# Altium project BQ_79600-Q1_BMS_Master.PrjPcb
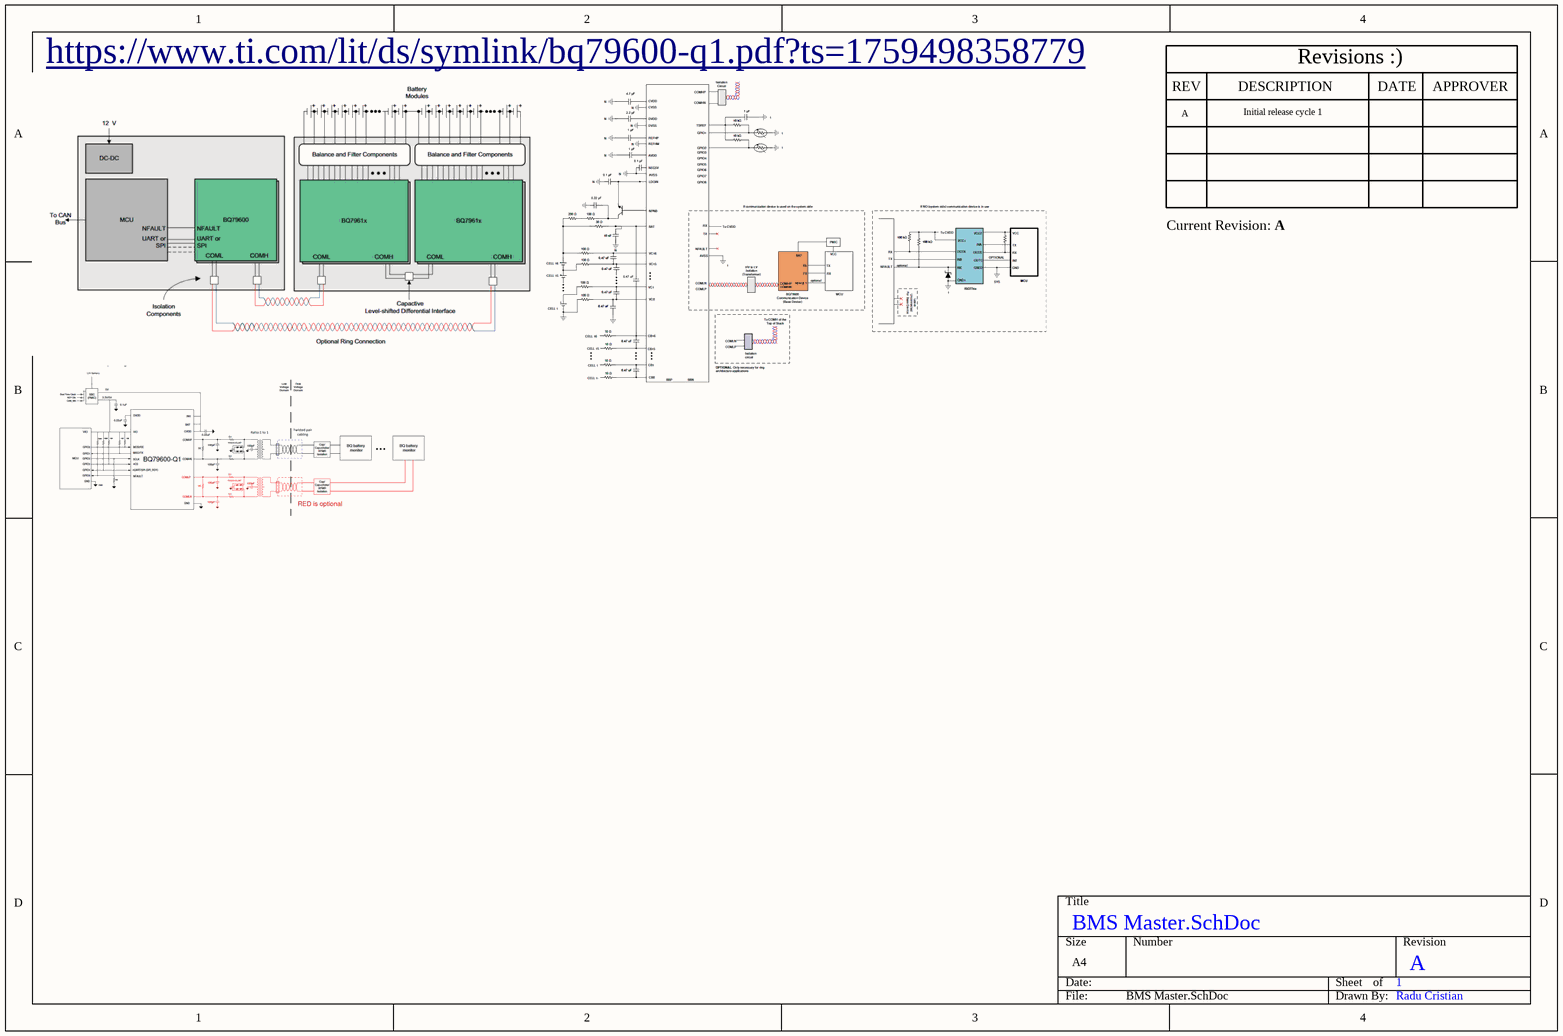
[diagram p0: BMS Master.SchDoc]
Revision: A
6 sheets, 76 parts. Net scope: flat (ports and power ports of the same name join across sheets).
Board file: Bms_Master_RevA.PcbDoc
Sheets:
  BMS Master.SchDoc
  BQ Chip.SchDoc
  MCU.SchDoc
  Communication.SchDoc
  Connectors.SchDoc
  Power.SchDoc

## Sheet BMS Master.SchDoc
size A4; SheetNumber: 1; SheetTotal: 6

### Notes on the sheet
- https://www.ti.com/lit/ds/symlink/bq79600-q1.pdf?ts=1759498358779
- REV
- A
- DESCRIPTION
- Initial release cycle 1
- Revisions :)
- DATE
- APPROVER
- Current Revision:
- Radu Cristian

## Sheet BQ Chip.SchDoc
size A4; SheetNumber: 2; SheetTotal: 6
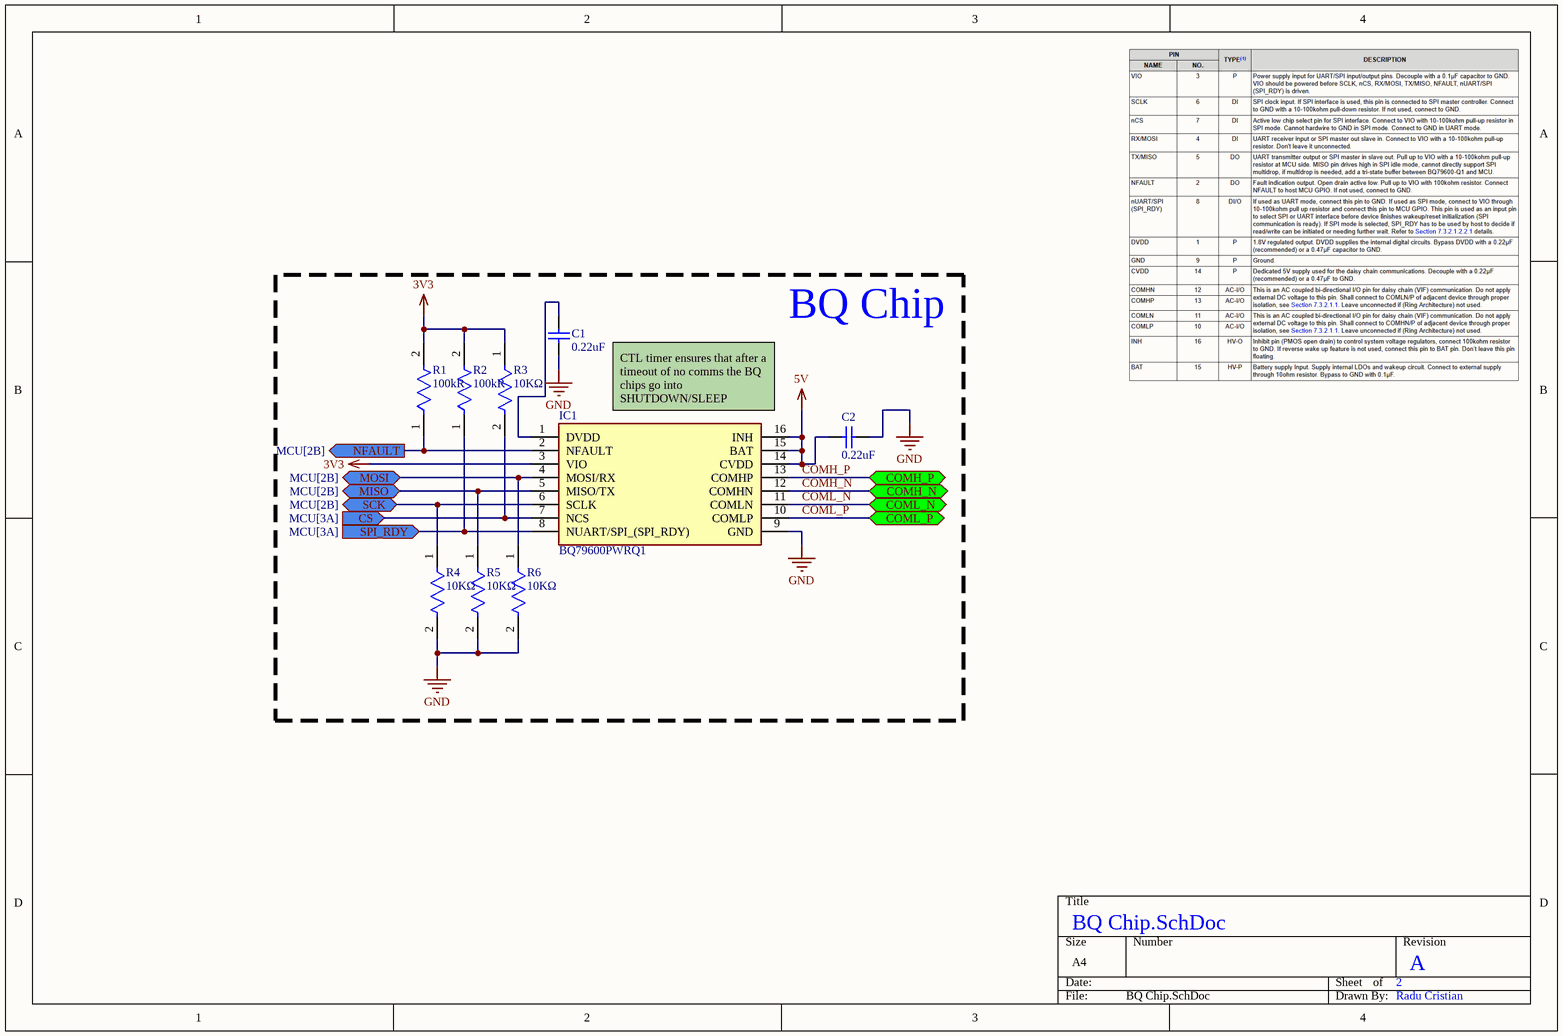
[diagram p1: BQ Chip.SchDoc]

### Parts
C1  Parameter 1: 0.22uF  [CAPC1608X95X40ML15T15]  (hidden comment: VJ0603Y224KXXCW1BC)
C2  Parameter 1: 0.22uF  [CAPC1608X95X40ML15T15]  (hidden comment: VJ0603Y224KXXCW1BC)
IC1  BQ79600PWRQ1  [SOP65P640X120-16N]
R1  Resistance: 100kR  [FP-MCT0603-IPC_C]  (hidden comment: MCT0603MC1003FP500)
R2  Resistance: 100kR  [FP-MCT0603-IPC_C]  (hidden comment: MCT0603MC1003FP500)
R3  Resistance: 10KΩ  [FP-CRGP0603-IPC_C]  (hidden comment: CRGP0603F10K)
R4  Resistance: 10KΩ  [FP-CRGP0603-IPC_C]  (hidden comment: CRGP0603F10K)
R5  Resistance: 10KΩ  [FP-CRGP0603-IPC_C]  (hidden comment: CRGP0603F10K)
R6  Resistance: 10KΩ  [FP-CRGP0603-IPC_C]  (hidden comment: CRGP0603F10K)

### Blocks framed on the sheet
BQ Chip: C1 C2 IC1 R1-R6

### Ports
COMH_N (bidir, see Communication[1B]), COMH_P (bidir, see Communication[1A]), COML_N (bidir, see Communication[1C]), COML_P (bidir, see Communication[1B]), CS (in, see MCU[3A]), MISO (bidir, see MCU[2B]), MOSI (bidir, see MCU[2B]), NFAULT (out, see MCU[2B]), SCK (bidir, see MCU[2B]), SPI_RDY (in, see MCU[3A])

### Nets
3V3: IC1.3(VIO) R1.2 R2.2 R3.1
5V: C2.2 IC1.14(CVDD) IC1.15(BAT) IC1.16(INH)
GND: C1.2 C2.1 IC1.9(GND) R4.2 R5.2 R6.2
COMH_N: IC1.12(COMHN) ; port COMH_N
COMH_P: IC1.13(COMHP) ; port COMH_P
COML_N: IC1.11(COMLN) ; port COML_N
COML_P: IC1.10(COMLP) ; port COML_P
CS: IC1.7(NCS) R3.2 ; port CS
MISO: IC1.5(MISO/TX) R5.1 ; port MISO
MOSI: IC1.4(MOSI/RX) R6.1 ; port MOSI
NFAULT: IC1.2(NFAULT) R1.1 ; port NFAULT
SCK: IC1.6(SCLK) R4.1 ; port SCK
SPI_RDY: IC1.8(NUART/SPI_(SPI_RDY)) R2.1 ; port SPI_RDY
NetC1_1: C1.1 IC1.1(DVDD)

### Notes on the sheet
- (near IC1) CTL timer ensures that after a  timeout of no comms the BQ chips go into SHUTDOWN/SLEEP
- Radu Cristian

### Library data of the parts
C1 C2 = CMP-2006-00068-1: Manufacturer: Vitramon; Part Number: VJ0603Y224KXXCW1BC
IC1 = BQ79600PWRQ1: Integrated Circuit; Manufacturer_Name: Texas Instruments; Datasheet Link: https://www.arrow.com/en/products/bq79600pwrq1/texas-instruments; Height: 1.2mm; Manufacturer_Part_Number: BQ79600PWRQ1; Mouser Part Number: 595-BQ79600PWRQ1; Mouser Price/Stock: https://www.mouser.co.uk/ProductDetail/Texas-Instruments/BQ79600PWRQ1?qs=bAKSY%2FctAC74v4PXQeVHrA%3D%3D; Arrow Part Number: BQ79600PWRQ1; Arrow Price/Stock: https://www.arrow.com/en/products/bq79600pwrq1/texas-instruments?region=nac
R1 R2 = CMP-02407-008119-1: RES SMD 100 OHM 1% 1/8W 0603; Voltage Rating: 75V; Power Rating: 125mW; Length: 1.55mm; Packaging: Tape and Reel; Width: 0.85mm; Case Code (Metric): 1608; Weight: 6.7E-05oz; Tolerance: 1%; Height: 0.45mm; Case Code (Imperial): 0603; Max Operating Temperature: 175°C; Case/Package: 0603; Min Operating Temperature: -55°C; Composition: Thin Film
R3-R6 = CMP-03211-004414-1: CRGP 0603 10K 1%; Manufacturer: TE; Voltage Rating: 50V; Power Rating: 0.25W; Value: 10KΩ; Tolerance: 0.01; Temperature Coefficient: ±100ppm/°C; Octopart: https://octopart.com/crgp0603f10k-te+connectivity-91018721; Temperature Range Low: -55°C; Temperature Range High: +155°C; Device Class L3: Chip SMD Resistors; Package: CRGP0603; Height: 0.55mm; Series: CRGP; RoHS: TRUE; Composition: Thick Film; Digikey Description: CRGP 0603 10K 1%; Ipc Land Pattern Name: RESC16080X45; Mouser Description: Res, 10K, 1%, 0.25W, 0603, Thick Film; ComponentLink2Description: Datasheet; ComponentLink2URL: https://www.te.com/commerce/DocumentDelivery/DDEController?Action=srchrtrv&DocNm=9-1773463-9&DocType=DS&DocLang=English; Manufacturer Part Number: CRGP0603F10K; Temperature: -55°C to +155°C; Device Class L1: Passive Components; Lead Free: Yes; Ambient Temperature Range High: +70°C; Device Class L2: Resistors; Automotive: No; Category: Res

## Sheet MCU.SchDoc
size A4; SheetNumber: 3; SheetTotal: 6
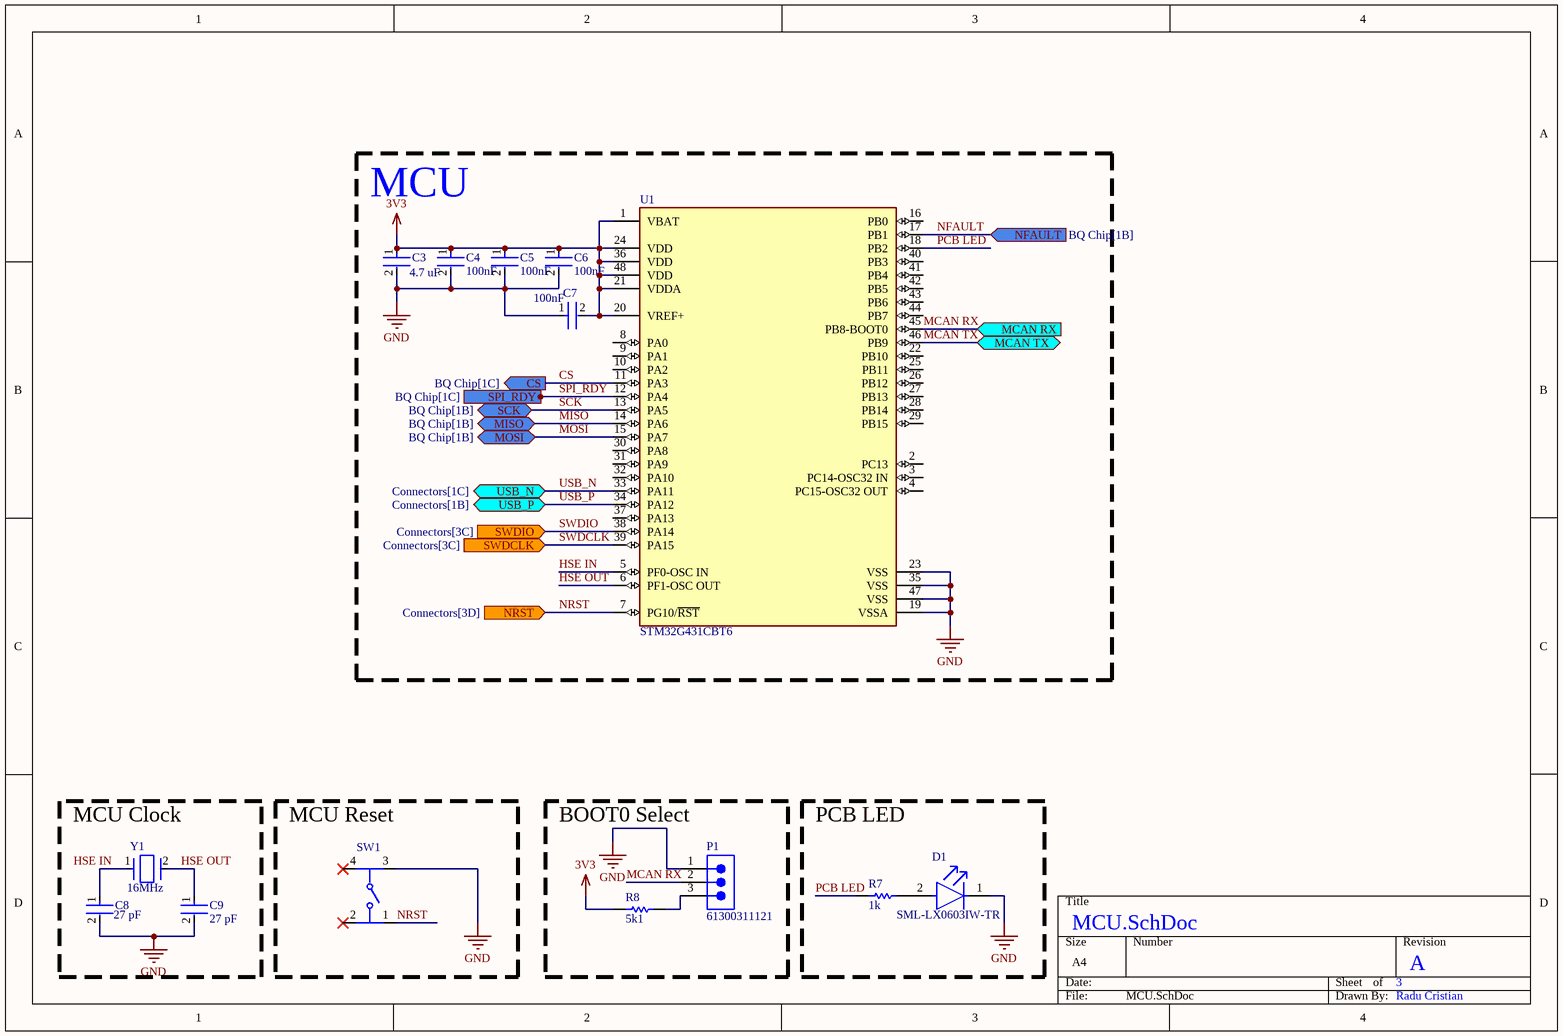
[diagram p2: MCU.SchDoc]

### Parts
C3  Capacitance: 4.7 uF  [FP-CC0603-DA-MFG]  (hidden comment: CC0603KRX5R5BB475)
C4  Capacitance: 100nF  [FP-CC0603-DA-IPC_A]  (hidden comment: CC0603JRX7R9BB104)
C5  Capacitance: 100nF  [FP-CC0603-DA-IPC_A]  (hidden comment: CC0603JRX7R9BB104)
C6  Capacitance: 100nF  [FP-CC0603-DA-IPC_A]  (hidden comment: CC0603JRX7R9BB104)
C7  Capacitance: 100nF  [FP-CC0603-DA-IPC_A]  (hidden comment: CC0603JRX7R9BB104)
C8  value 27 pF  [FP-C0603C-CF-MFG]  (hidden comment: C0603C270J5GACTU)
C9  value 27 pF  [FP-C0603C-CF-MFG]  (hidden comment: C0603C270J5GACTU)
D1  SML-LX0603IW-TR  [FP-SML-LX0603IW-TR-MFG]
P1  61300311121  [61300311121]
R7  Parameter 1: 1k  [RESC2013X70X40ML20T20]  (hidden comment: ERJ-6ENF1001V)
R8  Parameter 1: 5k1  [RESC2013X60X30NL20T20]  (hidden comment: RK73H2ATTD5101F)
SW1  PTS810SJM250SMTRLFS  [FP-PTS810SJM250SMTRLFS-MFG]  (value not drawn)
U1  STM32G431CBT6  [FP-LQFP48-5B-MFG]
Y1  Frequency: 16MHz  [FP-ABM3-MFG]  (hidden comment: ABM3-16.000MHZ-D2Y-T)

### Blocks framed on the sheet
MCU: C3-C7 U1
MCU Clock: C8 C9 Y1
MCU Reset: SW1
BOOT0 Select: P1 R8
PCB LED: D1 R7

### Ports
CS (out, see BQ Chip[1C]), MCAN RX (in, see Communication[1D]), MCAN TX (bidir, see Communication[1D]), MISO (bidir, see BQ Chip[1B]), MOSI (bidir, see BQ Chip[1B]), NFAULT (in, see BQ Chip[1B]), NRST (in, see Connectors[3D]), SCK (bidir, see BQ Chip[1B]), SPI_RDY (out, see BQ Chip[1C]), SWDCLK (in, see Connectors[3C]), SWDIO (in, see Connectors[3C]), USB_N (bidir, see Connectors[1C]), USB_P (bidir, see Connectors[1B])

### Nets
3V3: C3.1 C4.1 C5.1 C6.1 C7.2 R8.2 U1.1(VBAT) U1.20(VREF+) U1.21(VDDA) U1.24(VDD) U1.36(VDD) U1.48(VDD)
GND: C3.2 C4.2 C5.2 C6.2 C7.1 C8.2 C9.2 D1.1(C) P1.1 SW1.3 U1.19(VSSA) U1.23(VSS) U1.35(VSS) U1.47(VSS)
CS: U1.11(PA3) ; port CS
HSE IN: C8.1 U1.5(PF0-OSC_IN) Y1.1
HSE OUT: C9.1 U1.6(PF1-OSC_OUT) Y1.2
MCAN RX: P1.2 U1.45(PB8-BOOT0) ; port MCAN RX
MCAN TX: U1.46(PB9) ; port MCAN TX
MISO: U1.14(PA6) ; port MISO
MOSI: U1.15(PA7) ; port MOSI
NFAULT: U1.17(PB1) ; port NFAULT
NRST: SW1.1 U1.7(PG10/~{RST}) ; port NRST
PCB LED: R7.1 U1.18(PB2)
SCK: U1.13(PA5) ; port SCK
SPI_RDY: U1.12(PA4) ; port SPI_RDY
SWDCLK: U1.39(PA15) ; port SWDCLK
SWDIO: U1.38(PA14) ; port SWDIO
USB_N: U1.33(PA11) ; port USB_N
USB_P: U1.34(PA12) ; port USB_P
NetD1_2: D1.2(A) R7.2
NetP1_3: P1.3 R8.1

Not connected (* = marked no-connect by the designer): SW1 2* 4*; U1 2(PC13) 3(PC14-OSC32_IN) 4(PC15-OSC32_OUT) 8(PA0) 9(PA1) 10(PA2) 16(PB0) 22(PB10) 25(PB11) 26(PB12) 27(PB13) 28(PB14) 29(PB15) 30(PA8) 31(PA9) 32(PA10) 37(PA13) 40(PB3) 41(PB4) 42(PB5) 43(PB6) 44(PB7)

### Notes on the sheet
- Radu Cristian

### Library data of the parts
C3 = CMP-03422-000495-1: CAP CER 4.7UF 6.3V X5R 0603; Manufacturer: YAGEO; Tolerance: 0.1; Temperature Coefficient: 15%; Material: Ceramic; Voltage Rating: 6.3 V; Height: 0.9mm; Temperature Characteristic: X5R; Value: 4.7 uF; ComponentLink2Description: Datasheet; Mouser Description: Multilayer Ceramic Capacitor, CC Series, 4.7 - F, - 10%, X5R, 6.3 V, 0603 [1608 Metric]; Manufacturer Part Number: CC0603KRX5R5BB475; Voltage: 6.3 V; Device Class L3: Ceramic Capacitors; Temperature: -55°C to +125°C; Octopart: https://octopart.com/cc0603krx5r5bb475-yageo-42244632; Digikey Description: CAP CER 4.7UF 6.3V X5R 0603; Package: CC0603-DA; Device Class L2: Capacitors; Category: Cap; Footprint Url: http://www.yageo.com/exep/pages/download/literatures/UPY-C_GEN_24.pdf; ComponentLink2URL: http://www.yageo.com/documents/recent/UPY-GPHC_X7R_6.3V-to-50V_18.pdf; Temperature Range High: +125°C; Automotive: No; Temperature Range Low: -55°C; Lead Free: Yes; Device Class L1: Passive Components; RoHS: TRUE
C4-C7 = CMP-03422-001490-1: CAP CER 0.1UF 50V X7R 0603; Tolerance: 5%; Number of Pins: 2; Depth: 0.8mm; Weight: 7.1E-05oz; Radiation Hardening: No; Case Code (Metric): 1608; Dielectric: X7R; Max Operating Temperature: 125°C; Voltage Rating (DC): 50V; Case/Package: 0603; Halogen Free: Halogen Free; Mount: Surface Mount; Lead Free: Lead Free; Termination: SMD/SMT; RoHS Compliant: Yes; Length: 1.6mm; Series: CC; Resistor Type: Ceramic; Case Code (Imperial): 0603; Construction: Flat; Width: 0.031inch; Height: 0.8mm; Voltage Rating: 50V; Min Operating Temperature: -55°C; Thickness: 0.035inch; Packaging: Tape and Reel
C8 C9 = CMP-2006-03314-2: CAP CER 27PF 50V C0G/NP0 0603; Manufacturer: KEMET; Tolerance: 0.05; Material: Ceramic; Automotive Grade: Grade 1; Temperature Characteristic: C0G; Temperature Coefficient: 30ppm/°C; RoHS: TRUE; Lead Free: Yes; Automotive: Yes; Category: Cap; Digikey Description: CAP CER 27PF 50V C0G/NP0 0603; Device Class L3: Ceramic Capacitors; Capacitance: 27 pF; Temperature Range High: +125°C; Octopart: https://octopart.com/c0603c270j5gactu-kemet-136059; Temperature Range Low: -55°C; ComponentLink2URL: https://api.kemet.com/component-edge/download/datasheet/C0603C100J5GACAUTO.pdf; Device Class L2: Capacitors; Mouser Description: Multilayer Ceramic Capacitors MLCC - SMD/SMT 50volts 27pF C0G 5%; Device Class L1: Passive Components; ComponentLink2Description: Datasheet; Voltage Rating: 50 V; Package: C0603C-CF; Height: 0.87mm; Temperature: -55°C to +125°C; Manufacturer Part Number: C0603C270J5GACTU
D1 = CMP-57192-000012-1: LED RED DIFFUSED SMD; Luminous Intensity: 14mcd; Test Current: 20mA; Viewing Angle: 160°; Approvals: UL; Forward Voltage: 2V; Power Dissipation: 50mW; Dominant Wavelength: 635nm; Number of LEDs: 1; Lens Color: White; Height: 0.6mm; RoHS Compliant: Yes; Lead Free: Lead Free; Number of Pins: 2; Packaging: Tape and Reel; Case/Package: 0603; Length: 1.6mm; Color: Red; Max Operating Temperature: 85°C; Illumination Color: Red; Case Code (Metric): 1608; Diameter: 0.061inch; Min Operating Temperature: -25°C; Lens Style: Diffused; Mount: Surface Mount; Width: 0.8mm; Case Code (Imperial): 0603; Lens Transparency: Diffused; Wavelength: 635nm; Package Quantity: 1; Forward Current: 20mA
P1 = CMP-1502-01062-3: NexarPartId: 32855521; Current Rating: 3A; Voltage Rating: 250V; Number of Positions: 3; Pitch: 2.54mm; Contact Resistance: 20mΩ; Connector Type: Male Pin; Gender: Male; REACH SVHC: Unknown; Packaging: Bulk; Contact Material: Copper; Min Operating Temperature: -40°C; Number of Rows: 1; Orientation: Vertical; RoHS: Compliant; Contact Plating: Gold; Max Operating Temperature: 105°C; Mount: Through Hole; Height: 8.94mm; Operating Supply Voltage: 250V; Number of Pins: 3; Contact Mating Length: 5.9944mm; Number of Contacts: 3; Color: Black; Lead Free: Lead Free; Lead Pitch: 2.54mm; Termination: Solder
R7 = CMP-2001-04375-5: Chip Resistor, 1 KOhm, +/- 1%, 0.125 W, -55 to 155 degC, 0805 (2012 Metric), RoHS, Tape and Reel; Manufacturer: Panasonic; Voltage Rating: 150 V; ComponentLink1URL: http://www.panasonic.com/; ComponentLink2Description: Datasheet; REACH SVHC: Yes; ComponentLink1Description: Manufacturer URL; Length: 2 mm; Height: 0.6 mm; Package Quantity: 1; PackageDescription: 2-Pin Surface Mount Device, Body 2 x 1.25 mm; Packaging: Cut Tape; PackageReference: 0805; Max Operating Temperature: 155 degC; Mounting Technology: Surface Mount; ComponentLink2URL: http://industrial.panasonic.com/cdbs/www-data/pdf/RDA0000/AOA0000C86.pdf; DatasheetVersion: 04/2015; Min Operating Temperature: -55 degC; RoHSCompliant: true; Mount: Surface Mount
R8 = CMP-2001-02431-1: Manufacturer: KOA Speer; Part Number: RK73H2ATTD5101F
SW1 = CMP-10040-000001-2: SWITCH TACTILE SPST-NO 0.05A 16V; Throw Configuration: SPST; Operating Force: 160gf; Actuator Type: Standard; Switch Travel: 0.15mm; Switch Function: Off-Mom; Max Current Rating: 50mA; Mechanical Life: 150000Cycles; Illumination Type: Non-Illuminated; Package Quantity: 2900; Depth: 4.6mm; Mount: Surface Mount; Packaging: Tape and Reel; Length: 3.2mm; RoHS Compliant: Yes; Case/Package: SMD/SMT; Voltage Rating (DC): 16V; Min Operating Temperature: -40°C; Termination: J-Bend; Lead Free: Lead Free; Contact Plating: Silver; Orientation: Straight; Max Operating Temperature: 85°C; Current Rating: 50mA; Color: Black
U1 = CMP-12105-000030-1: MAINSTREAM ARM CORTEX-M4+ MCU 17; Manufacturer: STMicroelectronics; Number Of Adc Channels: 17; Number Of I/Os: 38; Standoff Height: 0.05mm; Number Of Usb Channels: 1; Data Bus Width: 32bits; Number Of I2C Channels: 3; Number Of Pwm Channels: 31; Frequency: 170MHz; Memory Type: FLASH; Number Of Timers/Counters: 14; Ram Size: 32KBytes; Max Junction Temp: +105°C; Memory Size: 128KBytes; Min Supply Voltage: 1.62V; Max Supply Voltage: 3.6V; Number Of Uart Channels: 4; Interface: I2C,SPI,UART,USART,CAN,USB,LIN,IrDA,I2S; Temperature Range Low: -40°C; Lead Free: Yes; Device Class L3: Microcontrollers; Number Of Cores: 1; Temperature Range High: +85°C; Height: 1.6mm; Digikey Description: MAINSTREAM ARM CORTEX-M4+ MCU 17; Device Class L1: Integrated Circuits (ICs); Package: LQFP48-5B; RoHS: TRUE; Number Of A/D Converters: 1; Core Architecture: Arm Cortex-M4; Device Class L2: Embedded Processors and Controllers; ComponentLink2Description: Datasheet; Temperature: -40°C to +85°C; Ambient Temperature Range High: +85°C; Ambient Temperature Range Low: -40°C; Octopart: https://octopart.com/stm32g431cbt6-stmicroelectronics-98835224; ComponentLink2URL: https://www.st.com/resource/en/datasheet/stm32g431cb.pdf; Automotive: No; Number Of Spi Channels: 3; Manufacturer Part Number: STM32G431CBT6; Category: IC
Y1 = CMP-27762-004490-1: Crystal 16MHz ±20ppm 18pF SMD-2 5mm x 3.2mm; Frequency Stability: 30ppm; Series Resistance: 40R; Tolerance: 20ppm; Frequency Tolerance: 20ppm; Load Capacitance: 18pF; Resistor Type: Ceramic; Termination: SMD/SMT; Width: 0.126inch; Mount: Surface Mount; RoHS Compliant: Yes; Package Quantity: 1000; Height: 0.051inch; Length: 0.197inch; Operating Frequency: 16 MHz; Packaging: Tape and Reel; Max Operating Temperature: 85°C; Series: ABM3; Case/Package: SMD/SMT; Lead Free: Lead Free; ESR (Equivalent Series Resistance): 40R; Number of Pins: 2; Min Operating Temperature: -40°C

## Sheet Communication.SchDoc
size A4; SheetNumber: 4; SheetTotal: 6
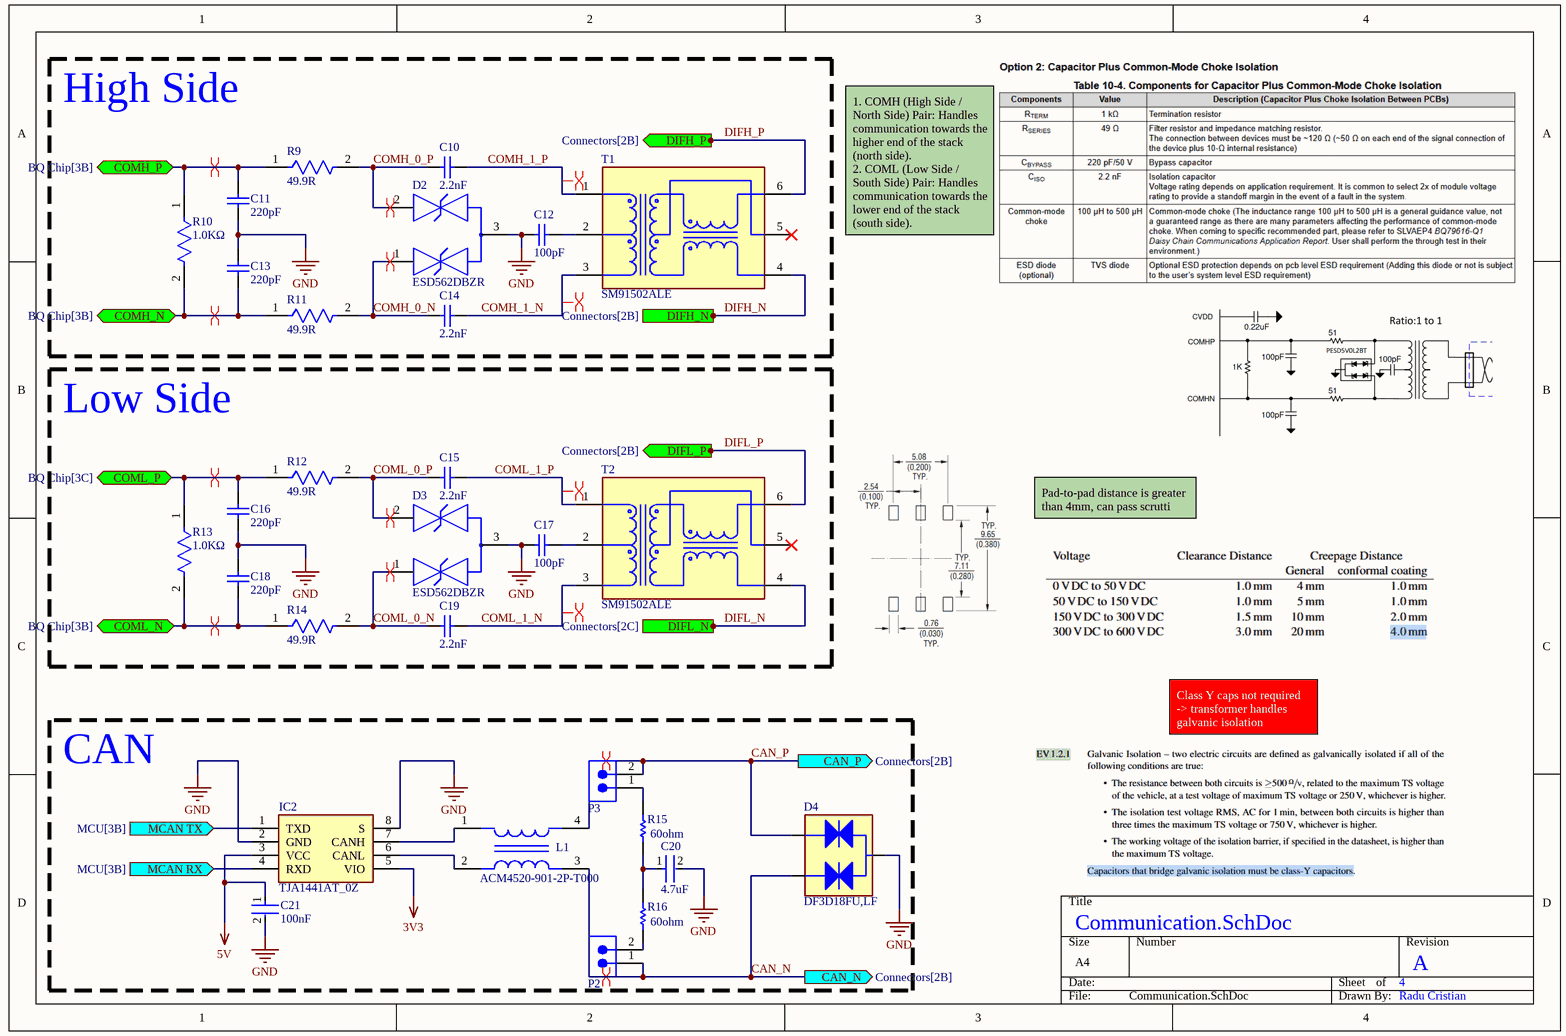
[diagram p3: Communication.SchDoc]

### Parts
C10  Parameter 1: 2.2nF  [CAPC1608X92X38ML15T08]  (hidden comment: VJ0603Y222JXBAC)
C11  value 220pF  [CAPC0603(1608)100_N]  (hidden comment: CAP 220pF 100V 0603(1608))
C12  Parameter 1: 100pF  [CAPC1608X90X35NL15T15]  (hidden comment: 06031A101J4T2A)
C13  value 220pF  [CAPC0603(1608)100_N]  (hidden comment: CAP 220pF 100V 0603(1608))
C14  Parameter 1: 2.2nF  [CAPC1608X92X38ML15T08]  (hidden comment: VJ0603Y222JXBAC)
C15  Parameter 1: 2.2nF  [CAPC1608X92X38ML15T08]  (hidden comment: VJ0603Y222JXBAC)
C16  value 220pF  [CAPC0603(1608)100_N]  (hidden comment: CAP 220pF 100V 0603(1608))
C17  Parameter 1: 100pF  [CAPC1608X90X35NL15T15]  (hidden comment: 06031A101J4T2A)
C18  value 220pF  [CAPC0603(1608)100_N]  (hidden comment: CAP 220pF 100V 0603(1608))
C19  Parameter 1: 2.2nF  [CAPC1608X92X38ML15T08]  (hidden comment: VJ0603Y222JXBAC)
C20  value 4.7uF  [FP-C0603C-CF-MFG]  (hidden comment: C0603C472J5RACTU)
C21  Capacitance: 100nF  [FP-CC0603-DA-IPC_A]  (hidden comment: CC0603JRX7R9BB104)
D2  ESD562DBZR  [FP-DBZ0003A-MFG]
D3  ESD562DBZR  [FP-DBZ0003A-MFG]
D4  DF3D18FU,LF  [SOT23-3]
IC2  TJA1441AT_0Z  [SOIC127P600X175-8N]
L1  ACM4520-901-2P-T000  [FP-ACM4520-MFG]
P2  62000211121  [62000211121]  (value not drawn)
P3  62000211121  [62000211121]  (value not drawn)
R9  Resistance: 49.9R  [FP-CRCW0603-HPe3-MFG]  (hidden comment: CRCW060349R9FKECHP)
R10  Resistance: 1.0KΩ  [FP-CPF0603-IPC_C]  (hidden comment: CPF0603F1K0C1)
R11  Resistance: 49.9R  [FP-CRCW0603-HPe3-MFG]  (hidden comment: CRCW060349R9FKECHP)
R12  Resistance: 49.9R  [FP-CRCW0603-HPe3-MFG]  (hidden comment: CRCW060349R9FKECHP)
R13  Resistance: 1.0KΩ  [FP-CPF0603-IPC_C]  (hidden comment: CPF0603F1K0C1)
R14  Resistance: 49.9R  [FP-CRCW0603-HPe3-MFG]  (hidden comment: CRCW060349R9FKECHP)
R15  Parameter 1: 60ohm  [RESC1608X55X30LL20T20]  (hidden comment: ERA3AEB620V)
R16  Parameter 1: 60ohm  [RESC1608X55X30LL20T20]  (hidden comment: ERA3AEB620V)
T1  SM91502ALE  [FP-SM91502ALE-MFG]
T2  SM91502ALE  [FP-SM91502ALE-MFG]

### Blocks framed on the sheet
High Side: C10-C14 D2 R9-R11 T1
Low Side: C15-C19 D3 R12-R14 T2
CAN: C20 C21 D4 IC2 L1 P2 P3 R15 R16

### Ports
CAN_N (out, see Connectors[2B]), CAN_P (out, see Connectors[2B]), COMH_N (bidir, see BQ Chip[3B]), COMH_P (bidir, see BQ Chip[3B]), COML_N (bidir, see BQ Chip[3B]), COML_P (bidir, see BQ Chip[3C]), DIFH_N (out, see Connectors[2B]), DIFH_P (out, see Connectors[2B]), DIFL_N (out, see Connectors[2C]), DIFL_P (out, see Connectors[2B]), MCAN RX (in, see MCU[3B]), MCAN TX (in, see MCU[3B])

### Nets
3V3: IC2.5(VIO)
5V: C21.1 IC2.3(VCC)
GND: C11.2 C12.1 C13.1 C16.2 C17.1 C18.1 C20.2 C21.2 D2.3(GND) D3.3(GND) D4.3 IC2.2(GND) IC2.8(S)
CAN_N: D4.1 L1.3 P2.1 ; port CAN_N
CAN_P: D4.2 L1.4 P3.2 ; port CAN_P
COMH_0_N: C14.2 D2.1(1_IO) R11.2
COMH_0_P: C10.2 D2.2(2_IO) R9.2
COMH_1_N: C14.1 T1.3
COMH_1_P: C10.1 T1.1
COMH_N: C13.2 R10.2 R11.1 ; port COMH_N
COMH_P: C11.1 R9.1 R10.1 ; port COMH_P
COML_0_N: C19.2 D3.1(1_IO) R14.2
COML_0_P: C15.2 D3.2(2_IO) R12.2
COML_1_N: C19.1 T2.3
COML_1_P: C15.1 T2.1
COML_N: C18.2 R13.2 R14.1 ; port COML_N
COML_P: C16.1 R12.1 R13.1 ; port COML_P
DIFH_N: T1.4 ; port DIFH_N
DIFH_P: T1.6 ; port DIFH_P
DIFL_N: T2.4 ; port DIFL_N
DIFL_P: T2.6 ; port DIFL_P
MCAN RX: IC2.4(RXD) ; port MCAN RX
MCAN TX: IC2.1(TXD) ; port MCAN TX
NetC12_2: C12.2 T1.2
NetC17_2: C17.2 T2.2
NetC20_1: C20.1 R15.1 R16.2
NetIC2_6: IC2.6(CANL) L1.2
NetIC2_7: IC2.7(CANH) L1.1
NetP2_2: P2.2 R16.1
NetP3_1: P3.1 R15.2

Not connected (* = marked no-connect by the designer): T1 5*; T2 5*

### Layout directives
differential pair: CAN_N, CAN_P, COMH_0_N, COMH_0_P, COMH_1_N, COMH_1_P, COMH_N, COMH_P, COML_0_N, COML_0_P, COML_1_N, COML_1_P, COML_N, COML_P

### Notes on the sheet
- 1. COMH (High Side / North Side) Pair: Handles communication towards the higher end of the stack (north side).
  2. COML (Low Side / South Side) Pair: Handles communication towards the lower end of the stack (south side).
- Pad-to-pad distance is greater than 4mm, can pass scrutti
- Class Y caps not required -> transformer handles galvanic isolation
- Radu Cristian

### Library data of the parts
C10 C14 C15 C19 = CMP-2006-01264-1: Manufacturer: Vitramon; Part Number: VJ0603Y222JXBAC
C11 C13 C16 C18 = CMP-1035-01477-1: CAP 220pF 100V ±10% 0603 (1608 Metric) Thickness 1mm SMD; Tolerance: Â±10%; Case-EIA: 0603; Case-Metric: 1608; Rated Voltage: 100 V; Max Thickness: 1 mm; Technology: SMT
C12 C17 = CMP-2006-04571-1: Manufacturer: AVX Interconnect / Elco; Part Number: 06031A101J4T2A
C20 = CMP-1035-02202-3: C0603C 4.7nF Ceramic Multilayer Capacitor; 50 VDC; +125degC; X7R Dielec; +/-5%; Manufacturer: KEMET; Tolerance: 0.05; Capacitance: 4,700 pF; Temperature Coefficient: 30ppm/°C; Automotive Grade: Grade 1; Voltage Rating: 50 V; Device Class L2: Capacitors; Temperature Range Low: -55°C; Automotive: Yes; Manufacturer Part Number: C0603C472J5RACTU; Height: 0.87mm; ComponentLink2Description: Datasheet; Mouser Description: Multilayer Ceramic Capacitors MLCC - SMD/SMT 50volts 4700pF X7R 5%; Material: Ceramic; Device Class L3: Ceramic Capacitors; Device Class L1: Passive Components; Category: Cap; Temperature: -55°C to +125°C; Octopart: https://octopart.com/c0603c472j5ractu-kemet-107195; Digikey Description: C0603C 4.7nF Ceramic Multilayer Capacitor; 50 VDC; +125degC; X7R Dielec; +/-5%; Package: C0603C-CF; Lead Free: Yes; RoHS: TRUE; ComponentLink2URL: https://api.kemet.com/component-edge/download/datasheet/C0603C100J5GACAUTO.pdf; Temperature Range High: +125°C; Temperature Characteristic: X7R
C21 = CMP-03422-001490-1: as C4 on sheet MCU; Number of Pins: 2; Depth: 0.8mm; Weight: 7.1E-05oz; Radiation Hardening: No; Case Code (Metric): 1608; Dielectric: X7R; Max Operating Temperature: 125°C; Voltage Rating (DC): 50V; Case/Package: 0603; Halogen Free: Halogen Free; Mount: Surface Mount; Lead Free: Lead Free; Termination: SMD/SMT; RoHS Compliant: Yes; Length: 1.6mm; Series: CC; Resistor Type: Ceramic; Case Code (Imperial): 0603; Construction: Flat; Width: 0.031inch; Height: 0.8mm; Voltage Rating: 50V; Min Operating Temperature: -55°C; Thickness: 0.035inch; Packaging: Tape and Reel
D2 D3 = CMP-00370-147404550-1: ESD562DBZR Two-channel bidirectional 12V ESD protection diode 3-SOT-23 -40 to 125; Manufacturer Lifecycle Status: ACTIVE; NexarPartId: 147404550; Thickness: 1mm; Length: 2.92mm; Number of Pins: 3; Height: 1.22mm; Lifecycle Status: Production; Width: 1.3mm; Case/Package: SOT-23
D4 = DF3D18FU,LF: ESD Suppressors / TVS Diodes ESD Protection Diode Bi-directional type; Manufacturer: Toshiba; Breakdown Voltage: 18.35V; Clamping Voltage: 33V; Max Breakdown Voltage: 20.5V; Min Breakdown Voltage: 16.2V; Number of Bidirectional Channels: 2; Peak Pulse Current: 2.5A; Peak Pulse Power: 80W; Peak Reverse Current: 100nA; Polarity: Bidirectional; Power Line Protection: No; Reverse Standoff Voltage: 12V; Supplier: DigiKey; Supplier Part Number: DF3D18FULFCT-ND; Manufacturer Part Number: DF3D18FU,LF; RoHS: Compliant; Category: TVS Diodes; Stock: 17327; Pricing: 1=0.38, 10=0.254, 100=0.172, 500=0.133, 1000=0.113 (USD); Contact Plating: Tin; Lifecycle Status: Production; Max Operating Temperature: 150°C; Mounting Technology: Surface Mount; Number of Elements: 2; Number of Terminals: 3; REACH SVHC: Yes; ComponentLink1URL: https://datasheet.octopart.com:443/DF3D18FU%2CLF-Toshiba-datasheet-181389782.pdf?src-supplier=IHS; ComponentLink1Description: https://datasheet.octopart.com:443/DF3D18FU%2CLF-Toshiba-datasheet-181389782.pdf?src-supplier=IHS; Supplier 1: Mouser; Supplier Part Number 1: 757-DF3D18FULF
IC2 = TJA1441AT_0Z: Integrated Circuit; Manufacturer_Name: NXP; Manufacturer_Part_Number: TJA1441AT/0Z; Datasheet Link: https://www.mouser.it/datasheet/2/302/TJA1441-1949304.pdf; Height: 1.75mm; Mouser Part Number: 771-TJA1441AT/0Z; Mouser Price/Stock: https://www.mouser.co.uk/ProductDetail/NXP-Semiconductors/TJA1441AT-0Z?qs=eP2BKZSCXI7fcqmlBnmIFw%3D%3D; Arrow Part Number: TJA1441AT/0Z; Arrow Price/Stock: https://www.arrow.com/en/products/tja1441at0z/nxp-semiconductors?region=nac
L1 = CMP-2000-05389-2: CMC 2.3A 2LN 900 OHM SMD; Max Current Rating: 2A; Number of Lines: 2; Impedance: 900R; Element Configuration: Dual; Insulation Resistance: 10MR; Test Frequency: 100MHz; DC Resistance (DCR): 60mR; Voltage Rating (DC): 50V; Number of Pins: 4; DC Current: 2A; Mount: Surface Mount; Current: 2A; REACH SVHC: No SVHC; Width: 4.5mm; Case/Package: 1808; Current Rating: 2.3A; Voltage Rating: 50V; Package Quantity: 1; Height: 2mm; Max DC Current: 2A; Packaging: Tape and Reel; Max Operating Temperature: 85°C; Lead Free: Lead Free; Length: 0.185inch; Series: ACM; Radiation Hardening: No; Max Voltage Rating (DC): 50V; Termination: Flat; Depth: 4.7mm; RoHS Compliant: Yes; DC Resistance-Max: 60mR; Min Operating Temperature: -40°C
P2 P3 = CMP-1502-00956-4: NexarPartId: 61924778; Current Rating: 2A; Operating Supply Voltage: 200V; Contact Resistance: 20mΩ; Number of Contacts: 2; Gender: Male; RoHS: Non-Compliant; Max Operating Temperature: 105°C; Voltage Rating: 200V; Contact Material: Gold; Height: 6.35mm; Number of Rows: 1; Lead Pitch: 2mm; Min Operating Temperature: -40°C; Number of Pins: 2; Orientation: Vertical
R9 R11 R12 R14 = CMP-02407-009504-1: RES Thick Film, 49.9Ω, 1%, 0.33W, 100ppm/°C, 0603; Power Rating: 100mW; Tolerance: 1%; Case/Package: 0603; Lead Free: Lead Free
R10 R13 = CMP-03211-002621-1: RES SMD 1.0KΩ 1% 1/16W 0603; Manufacturer: TE Connectivity; Power Rating: 0.063W; Voltage Rating: 50V; Temperature Coefficient: 50ppm/°C; Octopart: https://octopart.com/cpf0603f1k0c1-te+connectivity-42013134; packaging: 1k Reel; Category: Res; Device Class L3: Chip SMD Resistors; octopart_url: https://octopart.com/cpf0603f1k0c1-te+connectivity-42013134; Value: 1.0KΩ; Temperature: -55°C to +155°C; Composition: Thin Film; ComponentLink2URL: https://www.te.com/commerce/DocumentDelivery/DDEController?Action=showdoc&DocId=Data+Sheet%7F1773200%7FM%7Fpdf%7FEnglish%7FENG_DS_1773200_M.pdf%7F3-1676481-2; Tolerance: 1%; Automotive: No; Lead Free: Yes; Height: 0.55mm; Device Class L1: Passive Components; Device Class L2: Resistors; Ipc Land Pattern Name: RESC15580X45; Series: CPF; ComponentLink2Description: Datasheet; RoHS: TRUE; Package: CPF0603; Manufacturer Part Number: CPF0603F1K0C1; Temperature Range Low: -55°C; Temperature Range High: +155°C
R15 R16 = CMP-2000-00102-1: Manufacturer: Panasonic; Part Number: ERA3AEB620V
T1 T2 = CMP-07264-000001-1: BMS XFORMER 1-CH 1000V AECQ +125; Manufacturer: Bourns; Standoff Height: 0.13mm; Turns Ratio: 1:1; Automotive Grade: Grade 1; Isolation Voltage: 4300VDC; Return Loss: -22dB; Insertion Loss: -0.25dB; Height: 5.72mm; Automotive: Yes; Package: 0; Device Class L3: unset; ComponentLink2Description: Datasheet; Category: Trans; ComponentLink2URL: https://www.bourns.com/docs/product-datasheets/SM91502AL.pdf; Device Class L1: Passive Components; Manufacturer Part Number: SM91502ALE; Temperature Range High: +125°C; Digikey Description: BMS XFORMER 1-CH 1000V AECQ +125; RoHS: TRUE; Lead Free: Yes; Octopart: https://octopart.com/sm91502ale-bourns-95732123; Device Class L2: Transformers; Temperature: -40°C to +125°C; Temperature Range Low: -40°C

## Sheet Connectors.SchDoc
size A4; SheetNumber: 5; SheetTotal: 6
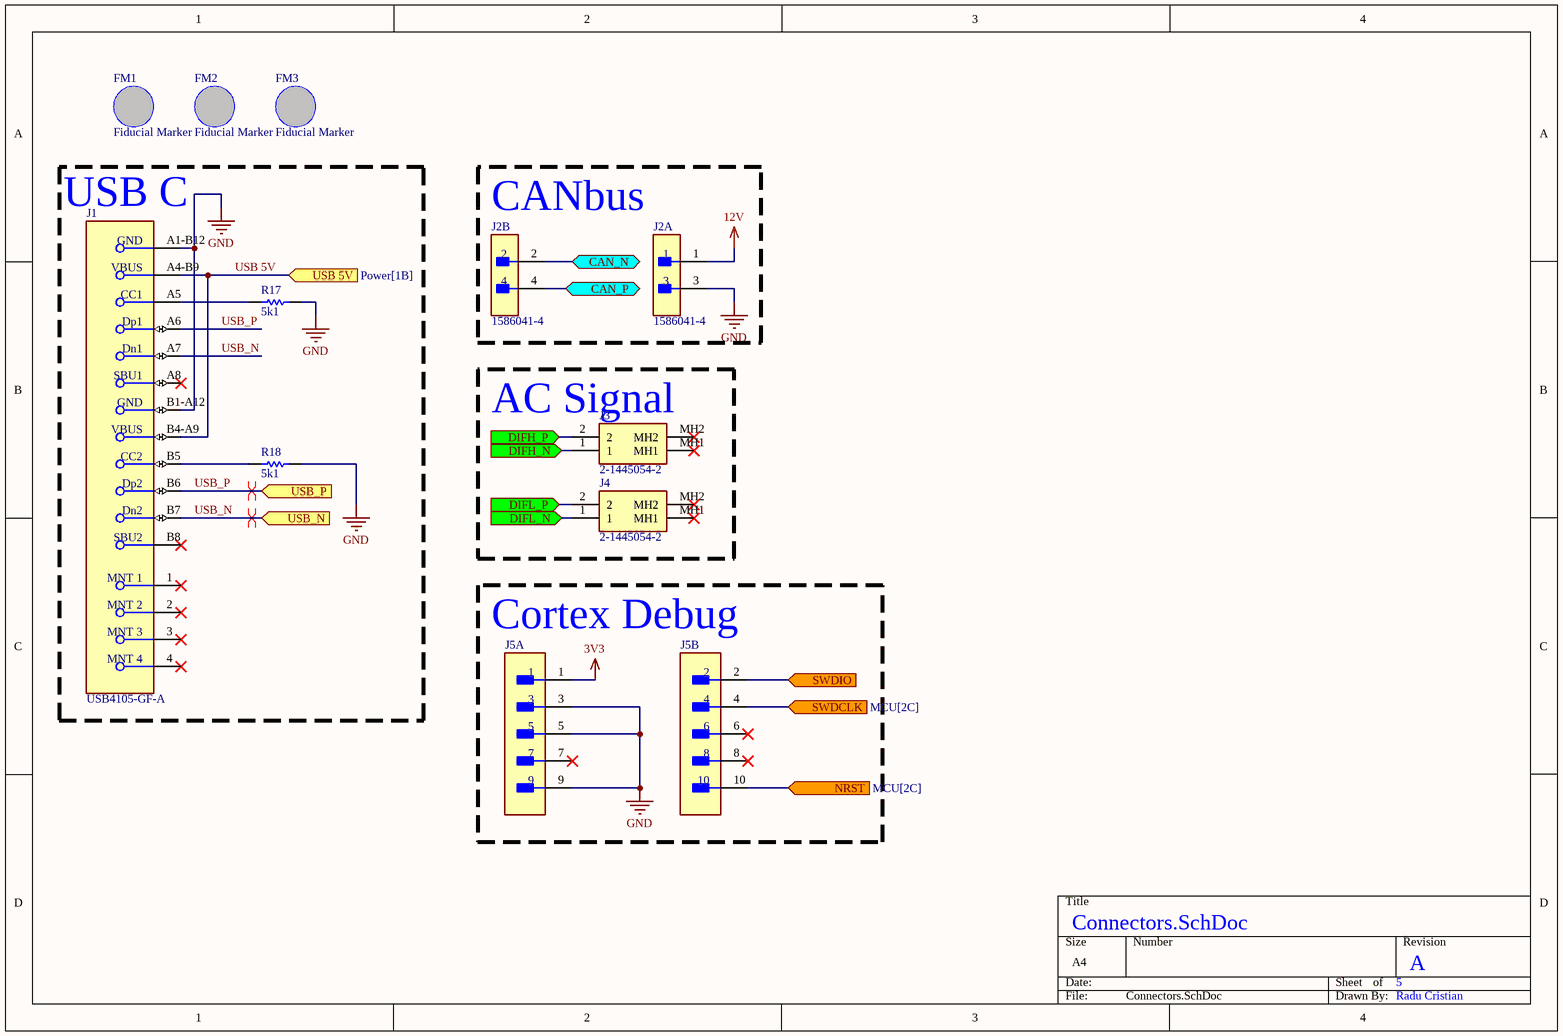
[diagram p4: Connectors.SchDoc]

### Parts
FM1  Fiducial Marker  [Fiducial Marker-Footprint-1]
FM2  Fiducial Marker  [Fiducial Marker-Footprint-1]
FM3  Fiducial Marker  [Fiducial Marker-Footprint-1]
J1  USB4105-GF-A  [FP-USB4105-GF-A-MFG]
J2  1586041-4  [FP-1586041-4-MFG]  (parts A,B of 2)
J3  2-1445054-2  [214450542]
J4  2-1445054-2  [214450542]
J5  FTSH-105-01-L-DV-K-P-TR  [FP-FTSH-105-01-L-DV-K-P-T-MFG]  (value not drawn)  (parts A,B of 2)
R17  Parameter 1: 5k1  [RESC2013X60X30NL20T20]  (hidden comment: RK73H2ATTD5101F)
R18  Parameter 1: 5k1  [RESC2013X60X30NL20T20]  (hidden comment: RK73H2ATTD5101F)

### Blocks framed on the sheet
USB C: J1 R17 R18
CANbus: J2
AC Signal: J3 J4
Cortex Debug: J5

### Ports
CAN_N (bidir, see Communication[2D]), CAN_P (bidir, see Communication[2C]), DIFH_N (in, see Communication[2B]), DIFH_P (in, see Communication[2A]), DIFL_N (in, see Communication[2C]), DIFL_P (in, see Communication[2B]), NRST (in, see MCU[2C]), SWDCLK (in, see MCU[2C]), SWDIO (in, see MCU[2C]), USB 5V (in, see Power[1B]), USB_N (in, see MCU[2B]), USB_P (in, see MCU[2B])

### Nets
3V3: J5.1
12V: J2.1
GND: J1.A1-B12(GND) J1.B1-A12(GND) J2.3 J5.3 J5.5 J5.9 R17.1 R18.1
CAN_N: J2.2 ; port CAN_N
CAN_P: J2.4 ; port CAN_P
DIFH_N: J3.1 ; port DIFH_N
DIFH_P: J3.2 ; port DIFH_P
DIFL_N: J4.1 ; port DIFL_N
DIFL_P: J4.2 ; port DIFL_P
NRST: J5.10 ; port NRST
SWDCLK: J5.4 ; port SWDCLK
SWDIO: J5.2 ; port SWDIO
USB 5V: J1.A4-B9(VBUS) J1.B4-A9(VBUS) ; port USB 5V
USB_N: J1.A7(Dn1) J1.B7(Dn2) ; port USB_N
USB_P: J1.A6(Dp1) J1.B6(Dp2) ; port USB_P
NetJ1_A5: J1.A5(CC1) R17.2
NetJ1_B5: J1.B5(CC2) R18.2

Not connected (* = marked no-connect by the designer): J1 1(MNT_1)* 2(MNT_2)* 3(MNT_3)* 4(MNT_4)* A8(SBU1)* B8(SBU2)*; J3 MH1* MH2*; J4 MH1* MH2*; J5 6* 7* 8*

### Layout directives
differential pair: USB_N, USB_P

### Notes on the sheet
- Radu Cristian

### Library data of the parts
FM1-FM3 = CMP-00003-4: fancy style
J1 = CMP-245163-000001-1: CONN RCPT USB2.0 TYPEC 5A; Manufacturer: GCT; Voltage Rating: 20V; Is Female: yes; Current Rating: 5/6.25/1.25/0.25A; Number Of Contacts: 16; Conn Orientation: Right Angle; Device Class L1: Connectors; Category: Conn; Lead Free: Yes; RoHS: TRUE; Temperature Range High: +85°C; Digikey Description: CONN RCPT USB2.0 TYPEC 5A; Device Class L3: unset; ComponentLink2Description: Datasheet; Manufacturer Part Number: USB4105-GF-A; Package: 0; Usb Standard: USB 2.0; Device Class L2: USB Connectors; Automotive: No; Temperature Range Low: -40°C; Height: 3.46mm; Temperature: -40°C to +85°C; Contact Material: Gold,Nickel; ComponentLink2URL: https://gct.co/files/drawings/usb4105.pdf; Octopart: https://octopart.com/usb4105-gf-a-gct-106627878
J2 = CMP-03369-000045-1: CONN HEADER R/A 4POS 4.2MM; Manufacturer: TE; Standoff Height: 0.4mm; Conn Gender: Male; Current Rating: 9A; Voltage Rating: 600V; Number Of Contacts: 4; Conn Orientation: Right Angle; Footprint Url: https://www.te.com/commerce/DocumentDelivery/DDEController?Action=showdoc&DocId=Customer+Drawing%7F1586041%7FB5%7Fpdf%7FEnglish%7FENG_CD_1586041_B5.pdf%7F1586041-4; Digikey Description: CONN HEADER R/A 4POS 4.2MM; Category: Conn; ComponentLink2URL: https://www.te.com/commerce/DocumentDelivery/DDEController?Action=showdoc&DocId=Specification+Or+Standard%7F108-2112%7FD2%7Fpdf%7FEnglish%7FENG_SS_108-2112_D2.pdf%7F1586041-8; Temperature: -40°C to +105°C; Lead Free: Yes; ComponentLink2Description: Datasheet; Pitch: 4.2mm; Number Of Rows: 2; Manufacturer Part Number: 1586041-4; Octopart: https://octopart.com/1586041-4-te+connectivity-46506786; Mouser Description: Header; Conn; Wire to Wire & Wire to Board; PCB Plug; 4 Cont; Solder; PE Series; 9A; Contact Material: Tin,Nickel; Package: 1586041-4; Device Class L1: Connectors; RoHS: TRUE; Temperature Range High: +105°C; Temperature Range Low: -40°C; Device Class L2: Headers and Wire Housings; Device Class L3: unset; Automotive: No
J3 J4 = 2-1445054-2: Connector; Manufacturer_Name: TE Connectivity; Datasheet Link: https://www.te.com/commerce/DocumentDelivery/DDEController?Action=srchrtrv&DocNm=micro-mate-n-lok-connector-qrg&DocType=Data%20Sheet&DocLang=English&PartCntxt=2-1445054-2&DocFormat=pdf; Height: 5.87mm; Manufacturer_Part_Number: 2-1445054-2; Mouser Part Number: 571-2-1445054-2; Mouser Price/Stock: https://www.mouser.co.uk/ProductDetail/TE-Connectivity-AMP/2-1445054-2?qs=FMZNX9%2FJjogUaikf%252BrNkUw%3D%3D; Arrow Part Number: 2-1445054-2; Arrow Price/Stock: https://www.arrow.com/en/products/2-1445054-2/te-connectivity?region=nac
J5 = CMP-2000-06292-2: CONN HEADER SMD 10POS 1.27MM; Gender: Male; Max Current Rating: 1.75A; Number of Contacts: 10; Contact Material: Bronze; Pitch: 1.27mm; Contact Plating: Gold; Orientation: Straight; RoHS Compliant: Yes; Housing Material: Polymer; Housing Color: Black; Length: 6.35mm; Number of Rows: 2; Lead Free: Lead Free; Max Operating Temperature: 125°C; Min Operating Temperature: -55°C; Radiation Hardening: No; Termination: Solder; Depth: 5.84mm; Packaging: Tape and Reel
R17 R18 = CMP-2001-02431-1: Manufacturer: KOA Speer; Part Number: RK73H2ATTD5101F

## Sheet Power.SchDoc
size A4; SheetNumber: 6; SheetTotal: 6
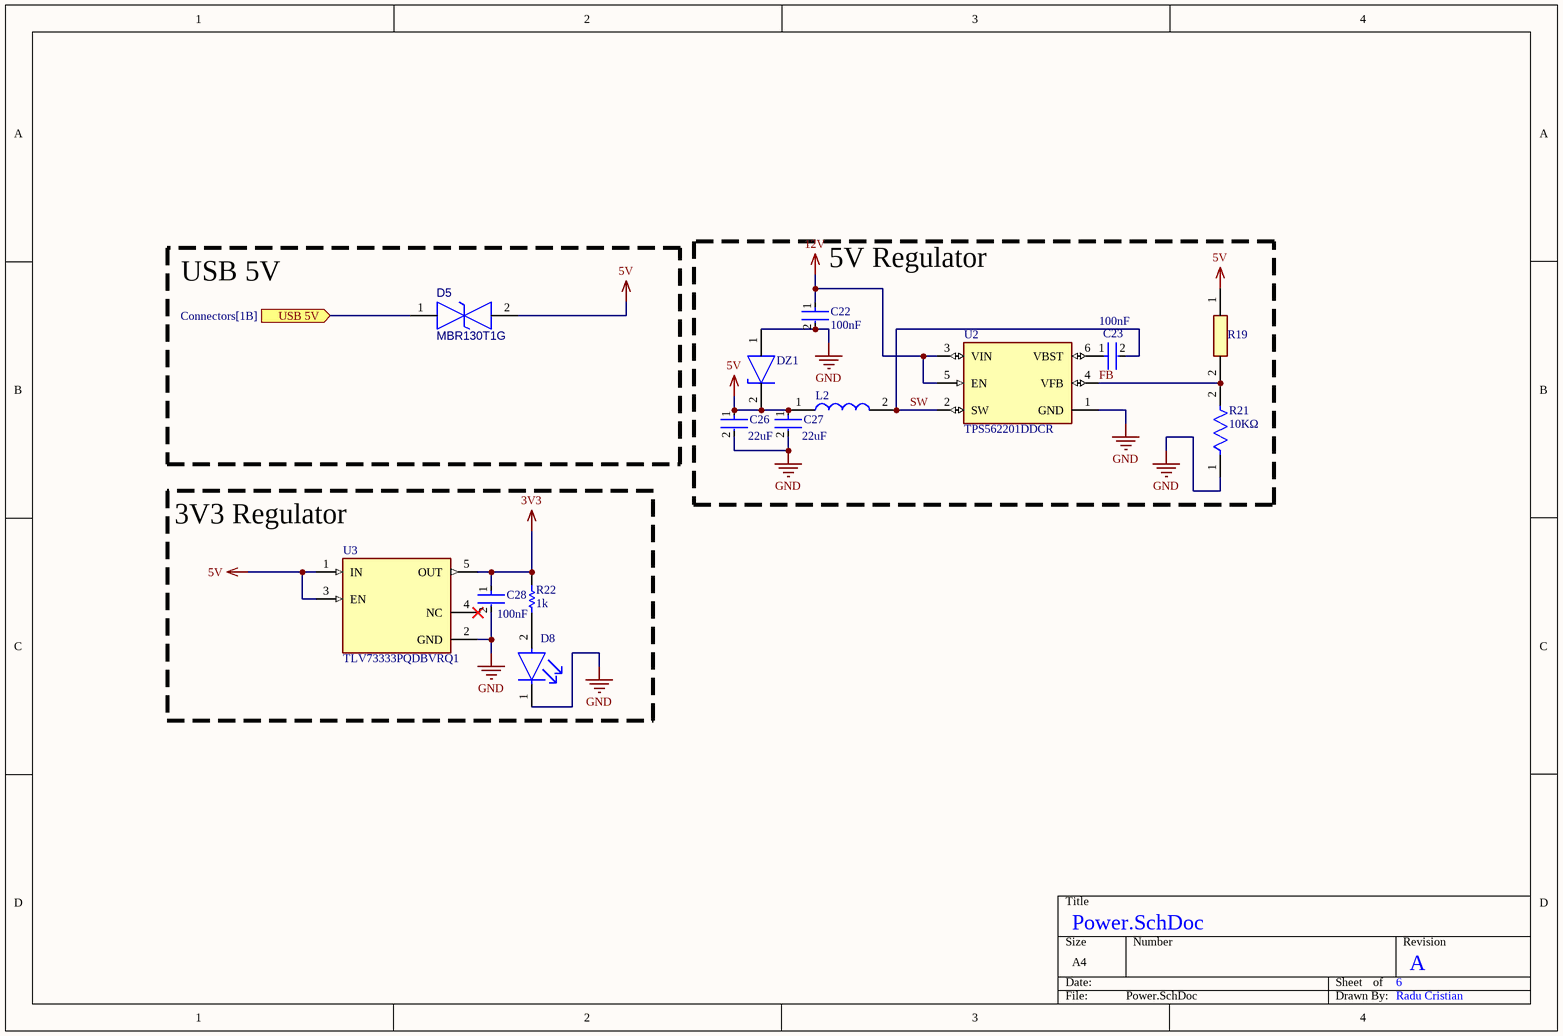
[diagram p5: Power.SchDoc]

### Parts
C22  Capacitance: 100nF  [FP-CC0603-DA-MFG]  (hidden comment: CC0603JRX7R9BB104)
C23  Capacitance: 100nF  [FP-CC0603-DA-MFG]  (hidden comment: CC0603JRX7R9BB104)
C26  Capacitance: 22uF  [FP-GRM188-0_2-IPC_C]  (hidden comment: GRM188R61A226ME15D)
C27  Capacitance: 22uF  [FP-GRM188-0_2-IPC_C]  (hidden comment: GRM188R61A226ME15D)
C28  Capacitance: 100nF  [FP-CC0603-DA-IPC_A]  (hidden comment: CC0603JRX7R9BB104)
D5  MBR130T1G  [ONSC-SOD-123-2-425-04_V]
D8  KPT-3216ID  [FP-APTD3216CGCK-MFG]  (value not drawn)
DZ1  VTVS5V0ASMF-M3-08  [FP-S8-V-3915_01-001-MFG]  (value not drawn)
L2  LCXHF3030QKT4R7MNR  [LCXHF3030QKT4R7MNR]  (value not drawn)
R19  ERA-3ARB563V  [ERA3AEB101V]  (value not drawn)
R21  Resistance: 10KΩ  [FP-CRGP0603-IPC_C]  (hidden comment: CRGP0603F10K)
R22  Parameter 1: 1k  [RESC2013X70X40ML20T20]  (hidden comment: ERJ-6ENF1001V)
U2  TPS562201DDCR  [FP-DDC0006A-IPC_C]
U3  TLV73333PQDBVRQ1  [FP-DBV0005A-IPC_A]

### Blocks framed on the sheet
5V Regulator: C22 C23 C26 C27 DZ1 L2 R19 R21 U2
USB 5V: D5
3V3 Regulator: C28 D8 R22 U3

### Ports
USB 5V (in, see Connectors[1B])

### Nets
3V3: C28.1 R22.1 U3.5(OUT)
5V: C26.1 C27.1 D5.2 DZ1.2(C) L2.1 R19.1 U3.1(IN) U3.3(EN)
12V: C22.1 U2.3(VIN) U2.5(EN)
GND: C22.2 C26.2 C27.2 C28.2 D8.1(C) DZ1.1(A) R21.1 U2.1(GND) U3.2(GND)
FB: R19.2 R21.2 U2.4(VFB)
SW: C23.2 L2.2 U2.2(SW)
USB 5V: D5.1 ; port USB 5V
NetC23_1: C23.1 U2.6(VBST)
NetD8_2: D8.2(A) R22.2

Not connected (* = marked no-connect by the designer): U3 4(NC)*

### Notes on the sheet
- Radu Cristian

### Library data of the parts
C22 C23 C28 = CMP-03422-001490-1: as C4 on sheet MCU; Number of Pins: 2; Depth: 0.8mm; Weight: 7.1E-05oz; Radiation Hardening: No; Case Code (Metric): 1608; Dielectric: X7R; Max Operating Temperature: 125°C; Voltage Rating (DC): 50V; Case/Package: 0603; Halogen Free: Halogen Free; Mount: Surface Mount; Lead Free: Lead Free; Termination: SMD/SMT; RoHS Compliant: Yes; Length: 1.6mm; Series: CC; Resistor Type: Ceramic; Case Code (Imperial): 0603; Construction: Flat; Width: 0.031inch; Height: 0.8mm; Voltage Rating: 50V; Min Operating Temperature: -55°C; Thickness: 0.035inch; Packaging: Tape and Reel
C26 C27 = CMP-2000-06337-3: Chip Multilayer Ceramic Capacitors for General Purpose, 0603, 22uF, X5R, 15%, 20%, 10V; Tolerance: 20%; Weight: 0.000222oz; Material: Ceramic; Depth: 0.8mm; Length: 1.6mm; Termination: SMD/SMT; Packaging: Tape and Reel; Width: 0.8mm; Voltage Rating: 10V; Case Code (Imperial): 0603; Mount: Surface Mount; Voltage Rating (DC): 10V; Case/Package: 0603; Thickness: 0.039inch; REACH SVHC: No SVHC; Dielectric: X5R; Height: 0.8mm; Package Quantity: 4000; Case Code (Metric): 1608; Min Operating Temperature: -55°C; Lead Free: Lead Free; Max Operating Temperature: 85°C
D5 = CMP-00002-1: Rectifier Diode, Schottky, 1 Phase, 1 Element, 1A, 30V V(RRM), Silicon; Forward Voltage: 350mV; Number of Elements: 1; Additional Feature: FREE WHEELING DIODE; Package Body Material: Plastic; Qualification Status: Not Qualified; Time @ Peak Reflow Temperature-Max (s): 40s; Non-rep Pk Forward Current-Max: 5.5A; Pins: 2; Technology: SCHOTTKY; Diode Type: RECTIFIER; RoHS Compliant: Yes; Max Output current: 1A; Min Operating Temperature: -65°C; Package Shape: Rectangular; Package Style: SMALL OUTLINEMeter; Rep Pk Reverse Voltage-Max: 30V; Moisture Sensitivity Level: 1; Terminal Finish: Tin; Terminal Position: DUAL; Peak Reflow Temperature (Cel): 260°C; Reach SVHC Compliant: Yes; Max Operating Temperature: 125°C; JESD-30 Code: R-PDSO-G2; Surface Mount: Yes; Diode Element Material: SILICON; JESD-609 Code: e3; Terminal Form: Gull Wing
D8 = CMP-2000-05792-2: LED RED CLEAR 2SMD; Forward Voltage: 2.1V; Forward Current: 20mA; Luminous Intensity: 300mcd; Number of LEDs: 1; Dominant Wavelength: 570nm; Illumination Color: Green; Viewing Angle: 50°; Lead Free: Lead Free; Lens Color: Clear; Mount: Surface Mount; Package Quantity: 2000; Height: 1.8mm; Number of Pins: 2; Test Current: 20mA; Case Code (Metric): 3216; Case/Package: 1206; Case Code (Imperial): 1206; Color: Green; Width: 1.6mm; Packaging: Tape and Reel; Min Operating Temperature: -40°C; Lens Style: Clear; Max Operating Temperature: 85°C; Length: 3.2mm
DZ1 = CMP-00030-74204661-1: VTVS5V0ASMF-M3-08 Esd Protection Diode Smf Do219Ab5%; 5V; ir5 A; ip43A; p400W; cd2095Pf; Breakdown Voltage: 6.4V; RoHS: Non-Compliant; Schedule B: 8541100080, 8541100080; NexarPartId: 74204661; Packaging: Cut Tape
L2 = LCXHF3030QKT4R7MNR: Inductor; Manufacturer_Name: TAIYO YUDEN; Datasheet Link: https://ds.yuden.co.jp/TYCOMPAS/ap/specSheet?pn=LCXHF3030QKT4R7MNR; Height: 1.5mm; Manufacturer_Part_Number: LCXHF3030QKT4R7MNR
R19 = ERA-3ARB563V: Resistor; Manufacturer_Name: Panasonic; Datasheet Link: https://industrial.panasonic.com/cdbs/www-data/pdf/RDM0000/AOA0000C307.pdf; Height: 0.55mm; Manufacturer_Part_Number: ERA-3ARB563V; Mouser Part Number: 667-ERA-3ARB563V; Mouser Price/Stock: https://www.mouser.co.uk/ProductDetail/Panasonic/ERA-3ARB563V?qs=ob%252BdNz2%252BYEjUxBvjNQsa6g%3D%3D
R21 = CMP-03211-004414-1: as R3 on sheet BQ Chip; Octopart: https://octopart.com/crgp0603f10k-te+connectivity-91018721; Temperature Range Low: -55°C; Temperature Range High: +155°C; Device Class L3: Chip SMD Resistors; Package: CRGP0603; Height: 0.55mm; Series: CRGP; RoHS: TRUE; Composition: Thick Film; Digikey Description: CRGP 0603 10K 1%; Ipc Land Pattern Name: RESC16080X45; Mouser Description: Res, 10K, 1%, 0.25W, 0603, Thick Film; ComponentLink2Description: Datasheet; ComponentLink2URL: https://www.te.com/commerce/DocumentDelivery/DDEController?Action=srchrtrv&DocNm=9-1773463-9&DocType=DS&DocLang=English; Manufacturer Part Number: CRGP0603F10K; Temperature: -55°C to +155°C; Device Class L1: Passive Components; Lead Free: Yes; Ambient Temperature Range High: +70°C; Device Class L2: Resistors; Automotive: No; Category: Res
R22 = CMP-2001-04375-5: as R7 on sheet MCU; ComponentLink1URL: http://www.panasonic.com/; ComponentLink2Description: Datasheet; REACH SVHC: Yes; ComponentLink1Description: Manufacturer URL; Length: 2 mm; Height: 0.6 mm; Package Quantity: 1; PackageDescription: 2-Pin Surface Mount Device, Body 2 x 1.25 mm; Packaging: Cut Tape; PackageReference: 0805; Max Operating Temperature: 155 degC; Mounting Technology: Surface Mount; ComponentLink2URL: http://industrial.panasonic.com/cdbs/www-data/pdf/RDA0000/AOA0000C86.pdf; DatasheetVersion: 04/2015; Min Operating Temperature: -55 degC; RoHSCompliant: true; Mount: Surface Mount
U2 = CMP-04918-000361-1: IC REG BUCK ADJ 2A TSOT23-6; Switching Frequency: 580kHz; Max Input Voltage: 17V; Number of Outputs: 1; Output Voltage: 7V; Output Type: Adjustable; Quiescent Current: 400uA; Min Input Voltage: 4.5V; Mount: Surface Mount; Max Operating Temperature: 125°C; Lead Free: Lead Free; Operating Supply Voltage: 17V; Number of Pins: 6; RoHS Compliant: Yes; Contact Plating: Tin; Min Operating Temperature: -40°C; Case/Package: SOT; Max Output Current: 2A
U3 = CMP-04917-000347-1: IC REG LINEAR 3.3V 300MA SOT23-5; RoHS Compliant: Yes

## Nets that join several sheets
3V3: BQ Chip (IC1.3 R1.2 R2.2 R3.1), MCU (12 pins), Communication (IC2.5), Connectors (J5.1), Power (C28.1 R22.1 U3.5)
5V: BQ Chip (C2.2 IC1.14 IC1.15 IC1.16), Communication (C21.1 IC2.3), Power (8 pins)
12V: Connectors (J2.1), Power (C22.1 U2.3 U2.5)
GND: BQ Chip (6 pins), MCU (14 pins), Communication (13 pins), Connectors (8 pins), Power (9 pins)
CAN_N: Communication (D4.1 L1.3 P2.1), Connectors (J2.2)
CAN_P: Communication (D4.2 L1.4 P3.2), Connectors (J2.4)
COMH_N: BQ Chip (IC1.12), Communication (C13.2 R10.2 R11.1)
COMH_P: BQ Chip (IC1.13), Communication (C11.1 R9.1 R10.1)
COML_N: BQ Chip (IC1.11), Communication (C18.2 R13.2 R14.1)
COML_P: BQ Chip (IC1.10), Communication (C16.1 R12.1 R13.1)
CS: BQ Chip (IC1.7 R3.2), MCU (U1.11)
DIFH_N: Communication (T1.4), Connectors (J3.1)
DIFH_P: Communication (T1.6), Connectors (J3.2)
DIFL_N: Communication (T2.4), Connectors (J4.1)
DIFL_P: Communication (T2.6), Connectors (J4.2)
MCAN RX: MCU (P1.2 U1.45), Communication (IC2.4)
MCAN TX: MCU (U1.46), Communication (IC2.1)
MISO: BQ Chip (IC1.5 R5.1), MCU (U1.14)
MOSI: BQ Chip (IC1.4 R6.1), MCU (U1.15)
NFAULT: BQ Chip (IC1.2 R1.1), MCU (U1.17)
NRST: MCU (SW1.1 U1.7), Connectors (J5.10)
SCK: BQ Chip (IC1.6 R4.1), MCU (U1.13)
SPI_RDY: BQ Chip (IC1.8 R2.1), MCU (U1.12)
SWDCLK: MCU (U1.39), Connectors (J5.4)
SWDIO: MCU (U1.38), Connectors (J5.2)
USB 5V: Connectors (J1.A4-B9 J1.B4-A9), Power (D5.1)
USB_N: MCU (U1.33), Connectors (J1.A7 J1.B7)
USB_P: MCU (U1.34), Connectors (J1.A6 J1.B6)